# Altium schematic sheet Optical Compressor V2.SchDoc (part 2 of 2)
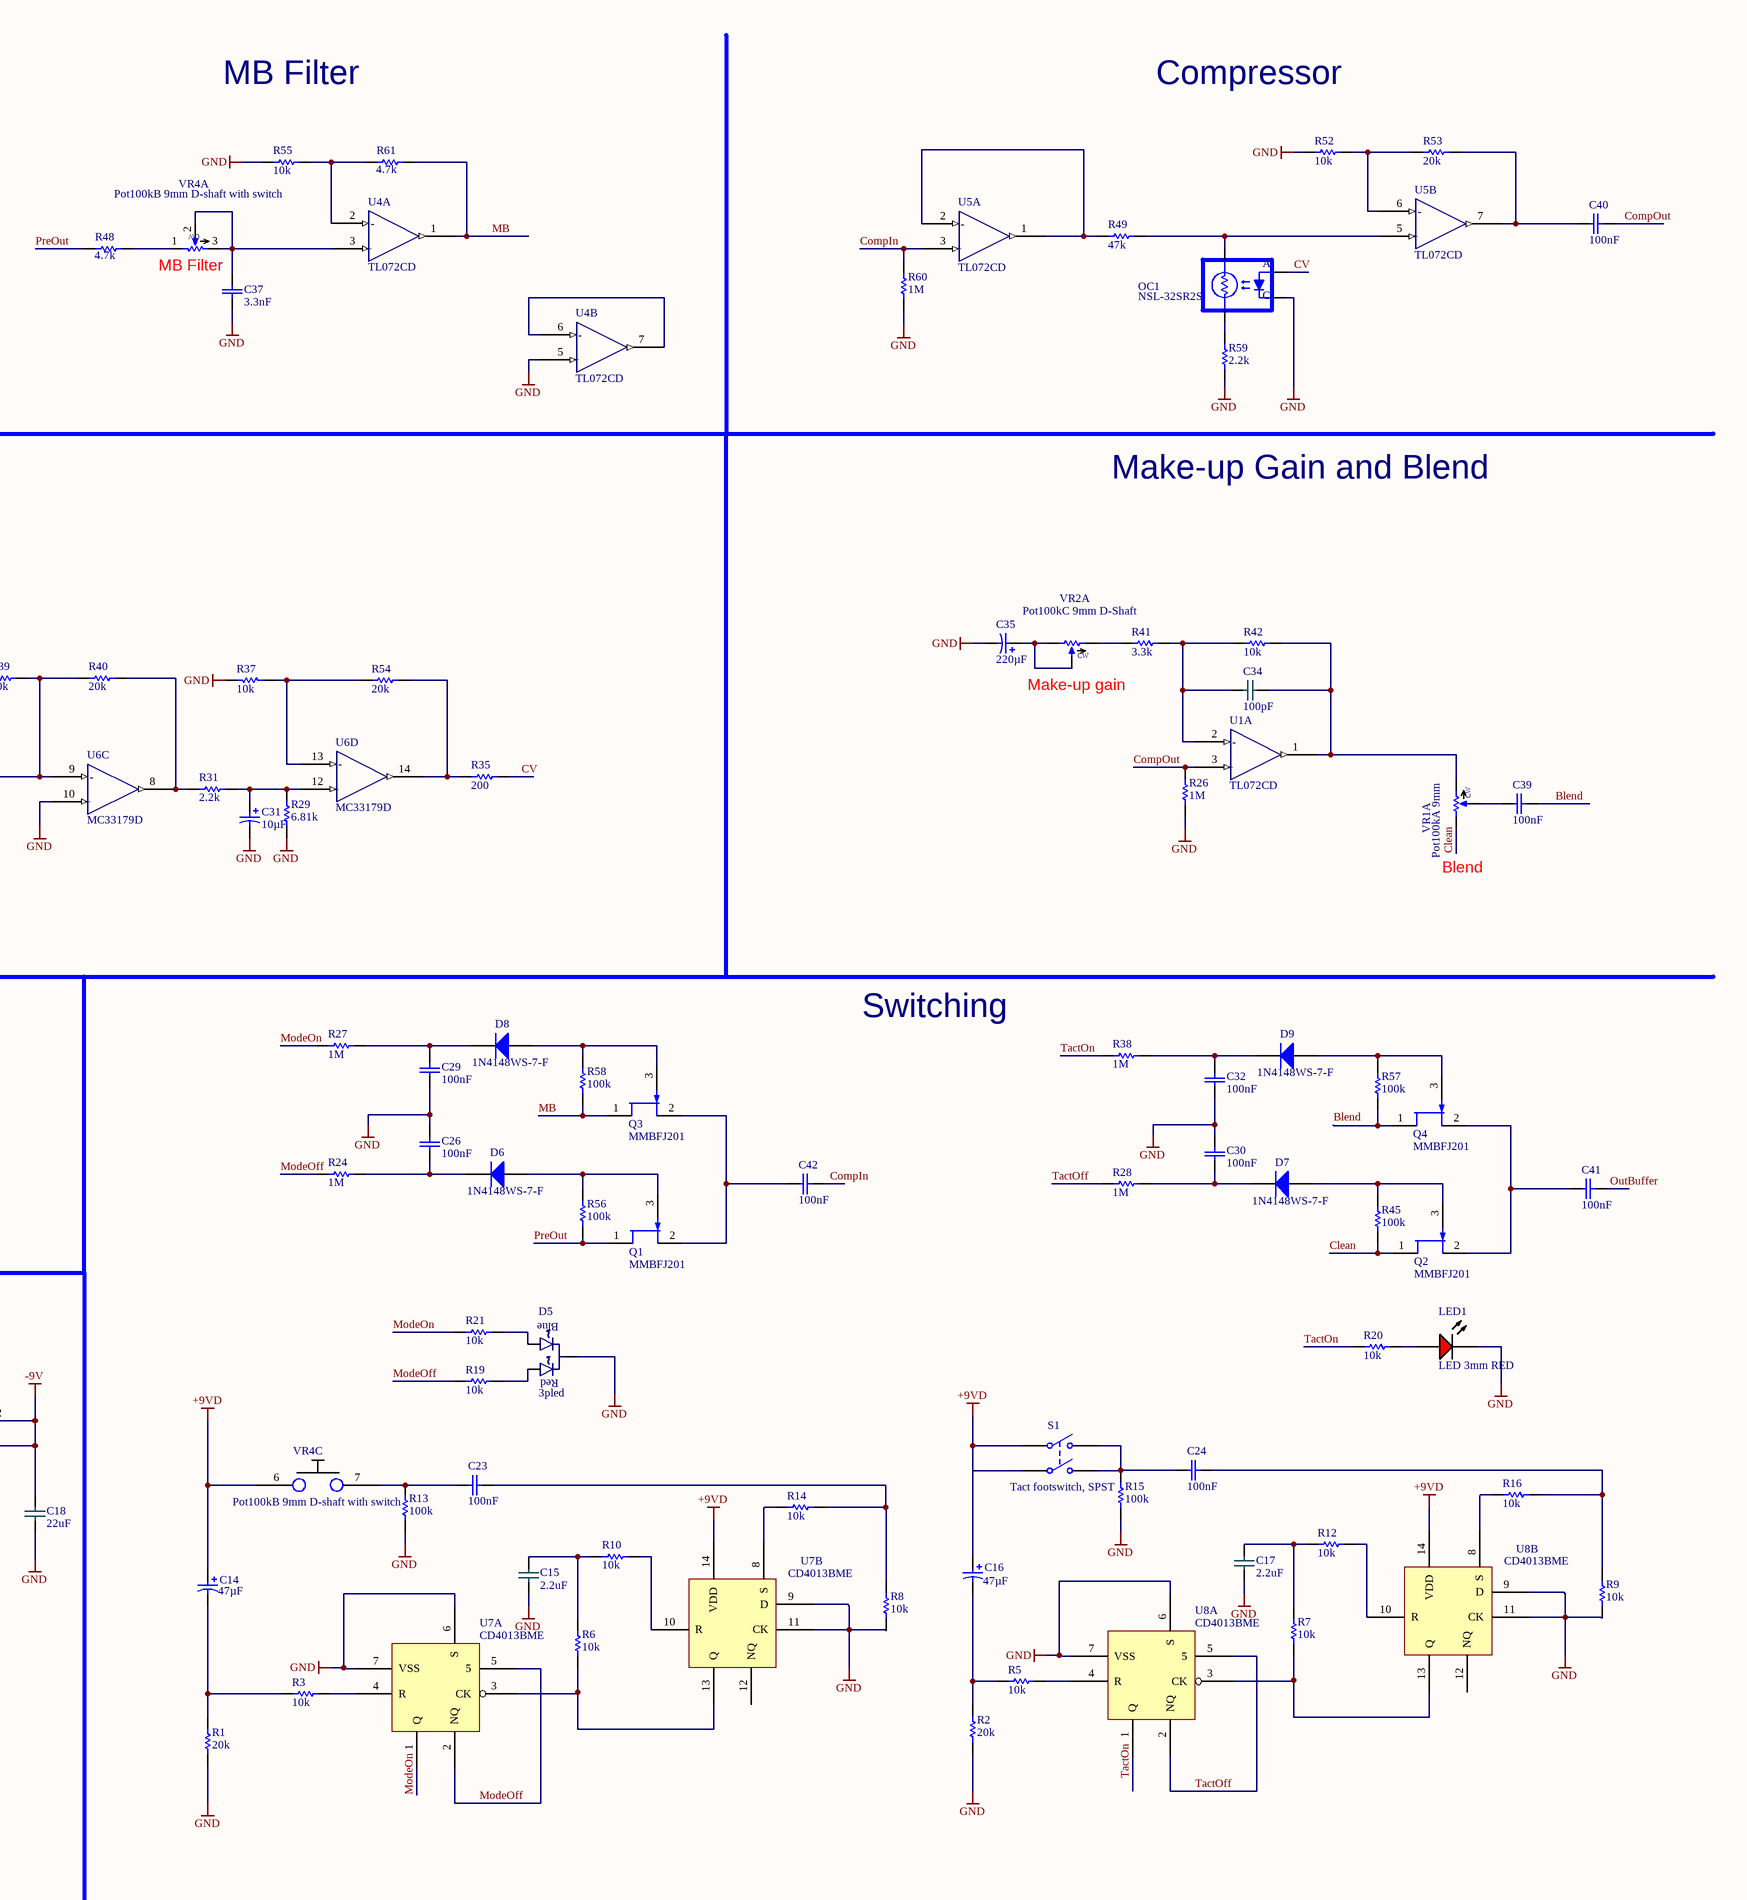
[diagram p2: Optical Compressor V2.SchDoc, right]

## Library data of the parts
C1 C19 C31 = CMP-00115-4: Cap Aluminum 10uF 35V ±20% (5x5.4mm) SMD 2000h 85°C; + Tolerance: 20%; Lifetime @ Max. Temp. (hours): 2000h; Maximum operating temperature: 85°C; Rated Voltage: 35V; - Tolerance: 20%
C2-C5 C7-C11 C13 C23 C24 C26 C27 C29 C30 C32 C38 = CMP-04109-3: Cap 100nF 0603 X7R 50V +-10%; Tolerance (+-): 10%; Dielectric: X7R; Height: 900µm; Maximum operating temperature: 125°C; Rated Voltage: 50V; Size (Imperial): 0603
C14 C16 = CMP-00096-4: Cap Aluminum 47uF 16V ±20% (6.3x5.4mm) SMD 2000h 85°C; Rated Voltage: 16V; + Tolerance: 20%; Lifetime @ Max. Temp. (hours): 2000h; Maximum operating temperature: 85°C; - Tolerance: 20%
C15 C17 = CMP-019-0081-11: 2.2uF, 25V, X5R, 20%; Dielectric Material: Ceramic; ComponentLink1Description: http://www.mouser.com/ds/2/427/vjw1bcbascomseries-223529.pdf?src-supplier=Mouser; ComponentLink6Description: https://datasheet.ciiva.com/14911/c-series-generalappl-b11-14911752.pdf?src-supplier=Digi-Key; ComponentLink1URL: http://www.mouser.com/ds/2/427/vjw1bcbascomseries-223529.pdf?src-supplier=Mouser; Width: 0.049inch; Dielectric: X5R; Termination: SMD/SMT; ComponentLink5URL: https://datasheet.ciiva.com/14911/c-series-generalappl-b11-14911751.pdf?src-supplier=Digi-Key; Source: main.SchLib; Number of Pins: 2; Voltage Rating: 25V; Composition: Ceramic; Package Quantity: 2000; Value: 2.2 uF; ComponentLink6URL: https://datasheet.ciiva.com/14911/c-series-generalappl-b11-14911752.pdf?src-supplier=Digi-Key; Packaging: Tape and Reel; ComponentLink2Description: http://www.vishay.com/docs/28548/vjw1bcbascomseries.pdf?src-supplier=Avnet; Tolerance: 20%; Voltage Rating (DC): 25V; Pricing 1: 1 = 0,27000, 10 = 0,11500, 50 = 0,11500, 100 = 0,07900, 1000 = 0,05900, 10000 = 0,04200 (USD); Weight: 0.000194oz; Case Code (Metric): 2012; ComponentLink4URL: https://datasheet.ciiva.com/14911/c-series-generalappl-b11-14911750.pdf?src-supplier=Digi-Key; Mount: Surface Mount; RoHS: Yes; Design Item ID: Cap 0805 2.2uF; Lead Free: Lead Free; Max Operating Temperature: 85°C; ComponentLink2URL: http://www.vishay.com/docs/28548/vjw1bcbascomseries.pdf?src-supplier=Avnet; Stock 1: 3928; Length: 2mm; ComponentLink4Description: https://datasheet.ciiva.com/14911/c-series-generalappl-b11-14911750.pdf?src-supplier=Digi-Key; Min Operating Temperature: -55°C; ComponentLink5Description: https://datasheet.ciiva.com/14911/c-series-generalappl-b11-14911751.pdf?src-supplier=Digi-Key; Case Code (Imperial): 0805; Case/Package: 0805; ComponentLink3URL: https://datasheet.ciiva.com/24219/c2012x5r1e225m125ac-265004-24219065.pdf?src-supplier=Mouser; ComponentLink3Description: https://datasheet.ciiva.com/24219/c2012x5r1e225m125ac-265004-24219065.pdf?src-supplier=Mouser; Thickness: 0.057inch; Height: 1.25mm; REACH SVHC: Unknown
C18 C21 = CMP-019-0032-4: 22uF, 16V, X5R, 20%; Dissipation Factor: 0.035%; Dielectric Material: Ceramic; Source: main.SchLib; PackageReference: C1206; Voltage Rating (DC): 16V; Tolerance: 20%; Depth: 1.25mm; LatestRevisionDate: 29-May-2009; Height: 0.85mm; Termination: SMD/SMT; Lead Free: Lead Free; Width: 0.049inch; Min Operating Temperature: -55°C; RoHS: Yes; Voltage Rating: 16V; PackageDescription: Chip Capacitor; Stock 1: 446787; Mount: Surface Mount; Case Code (Metric): 2012; Published: 8-Jun-2000; Design Item ID: Cap 0805 22uF; Dielectric: X5R; Capacitance: 22uF; Thickness: 0.039inch; Packaging: Tape and Reel; Case/Package: 0805; Weight: 0.000335oz; Max Operating Temperature: 85°C; REACH SVHC: No SVHC; Pricing 1: 1 = 0,49000, 10 = 0,34000, 50 = 0,34000, 100 = 0,22400, 1000 = 0,14100, 10000 = 0,11200 (USD); Voltage: 16V; Publisher: Altium Limited; Length: 2mm; Case Code (Imperial): 0805; Package Quantity: 3000; LatestRevisionNote: IPC-7351 Footprint Added.
C20 C35 = CMP-00098-4: Cap Aluminum 220uF 16V ±20% (6.3x7.7mm) SMD 2000h 85°C; Lifetime @ Max. Temp. (hours): 2000h; Rated Voltage: 16V; Maximum operating temperature: 85°C; - Tolerance: 20%; + Tolerance: 20%
C22 = CMP-019-0066-14: 330pF,  5%,  50V,  C0G; Dielectric Material: Ceramic; Temperature Coefficient: 30ppm/°C; Dissipation Factor: 0.5%; Tolerance: 5%; REACH SVHC: No SVHC; RoHS: Yes; Contact Material: Tin; Height: 0.8mm; Package Quantity: 1; ComponentLink5URL: https://datasheet.ciiva.com/14597/70095383-14597551.pdf?src-supplier=Allied+Electronics; Width: 0.8mm; Lead Pitch: 0.7mm; ComponentLink2Description: https://datasheet.ciiva.com/14589/70095383-14589452.pdf?src-supplier=Allied+Electronics; Max Operating Temperature: 125°C; Radiation Hardening: No; Voltage Rating: 50V; Dielectric: C0G; ComponentLink4Description: https://datasheet.ciiva.com/7823/kem-c1003-c0g-smd-7823742.pdf?src-supplier=Element14; Case Code (Metric): 1608; ComponentLink2URL: https://datasheet.ciiva.com/14589/70095383-14589452.pdf?src-supplier=Allied+Electronics; Lead Free: Lead Free; Termination: SMD/SMT; Capacitance: 330pF; Stock 1: 158995; ComponentLink3Description: https://datasheet.ciiva.com/7823/kem-c1003-c0g-smd-7823741.pdf?src-supplier=Element14; Number of Pins: 2; Thickness: 0.034inch; Contact Plating: Tin,Matte; ComponentLink1Description: https://datasheet.ciiva.com/144/docfinderpartnumber-c0603c331j5gactu-144424.pdf?src-supplier=Digi-Key; ComponentLink5Description: https://datasheet.ciiva.com/14597/70095383-14597551.pdf?src-supplier=Allied+Electronics; Mount: Surface Mount,PCB; Packaging: Tape and Reel; ComponentLink4URL: https://datasheet.ciiva.com/7823/kem-c1003-c0g-smd-7823742.pdf?src-supplier=Element14; Pricing 1: 1=0,100000, 10=0,039000, 100=0,027000, 500=0,020000, 1000=0,016000, 4000=0,011000 (USD); Source: main.SchLib; ComponentLink3URL: https://datasheet.ciiva.com/7823/kem-c1003-c0g-smd-7823741.pdf?src-supplier=Element14; Design Item ID: Cap 0603 330pF; Depth: 0.8mm; Length: 1.6mm; Case Code (Imperial): 0603; Case/Package: 0603; Voltage: 50V; Min Operating Temperature: -55°C; Voltage Rating (DC): 50V; ComponentLink1URL: https://datasheet.ciiva.com/144/docfinderpartnumber-c0603c331j5gactu-144424.pdf?src-supplier=Digi-Key
C25 = CMP-04113-3: Cap 1µF 0805 X7R 50V +-10%; Tolerance (+-): 10%; Dielectric: X7R; Maximum operating temperature: 125°C; Height: 1.45mm; Size (Imperial): 0805; Rated Voltage: 50V
C28 C39-C42 = CMP-04102-2: Cap 100nF 1206 C0G 50V +-5%; Tolerance (+-): 5%; Dielectric: C0G; Height: 1.8mm; Size (Imperial): 1206; Rated Voltage: 50V; Maximum operating temperature: 125°C
C33 = CMP-04095-2: Cap 10nF 0603 C0G 50V +-5%; Tolerance (+-): 5%; Dielectric: C0G; Maximum operating temperature: 125°C; Height: 900µm; Size (Imperial): 0603; Rated Voltage: 50V
C34 = CMP-019-0054-13: 100pF, 50V, COG,  5%; Dielectric: C0G; Case/Package: 0603; Design Item ID: Cap 0603 100pF; Length: 0.063inch; Max Operating Temperature: 125°C; Min Operating Temperature: -55°C; Mount: Surface Mount; Packaging: Cut Tape; Pricing 1: 1 = 0,10000, 10 = 0,02400, 50 = 0,02400, 100 = 0,02200, 1000 = 0,01900, 10000 = 0,01100 (USD); RoHS: Yes; Source: main.SchLib; Stock 1: 12395; Tolerance: 5%; Value: 100pF; Voltage Rating (DC): 50V; Case Code (Imperial): 0603; Case Code (Metric): 1608; LatestRevisionDate: 29-May-2009; LatestRevisionNote: IPC-7351 Footprint Added.; PackageDescription: Chip Capacitor; PackageReference: C1206; Published: 8-Jun-2000; Publisher: Altium Limited; REACH SVHC: Unknown; Thickness: 0.034inch; Voltage Rating: 50V; Width: 0.031inch
C36 = CMP-04086-1: Cap 100pF 0603 C0G 50V +-5%; Tolerance (+-): 5%; Maximum operating temperature: 125°C; Rated Voltage: 50V; Dielectric: C0G; Height: 900µm; Size (Imperial): 0603
C37 = CMP-04092-2: Cap 3.3nF 0603 C0G 50V +-5%; Tolerance (+-): 5%; Maximum operating temperature: 125°C; Size (Imperial): 0603; Dielectric: C0G; Rated Voltage: 50V; Height: 900µm
D1 D3 = CMP-029-0015-3: 12V Zener; Manufacturer: Vishay Semiconductors; Impedance: 9R; Power Dissipation: 1W; Tolerance: 10%; Element Configuration: Single; Max Reverse Leakage Current: 5uA; ComponentLink3Description: http://www.vishay.com/docs/85782/sml4728.pdf?src-supplier=Avnet; Package Quantity: 7500; Source: main.SchLib; ComponentLink2Description: http://www.mouser.com/ds/2/427/sml4728-67952.pdf?src-supplier=Mouser; Manufacturer Part Number: SML4742-E3/5A; Mount: Surface Mount; RoHS: Yes; Max Power Dissipation: 1W; Number of Pins: 2; ComponentLink1URL: https://media.digikey.com/pdf/Data%20Sheets/Vishay%20Siliconix%20PDFs/SML4728-SML4764A.pdf?src-supplier=Digi-Key; Radiation Hardening: No; ComponentLink1Description: https://media.digikey.com/pdf/Data%20Sheets/Vishay%20Siliconix%20PDFs/SML4728-SML4764A.pdf?src-supplier=Digi-Key; Stock 1: 7485; ComponentLink2URL: http://www.mouser.com/ds/2/427/sml4728-67952.pdf?src-supplier=Mouser; Packaging: Tape and Reel; Voltage Tolerance: 10%; Min Operating Temperature: -65°C; Pricing 1: 1 = 0,50000, 10 = 0,42600, 25 = 0,39760, 100 = 0,31800, 250 = 0,29524, 500 = 0,24982, 1000 = 0,19305, 2500 = 0,17602 (USD); Case/Package: SMA; Design Item ID: SML4742-E3/5A; Zener Voltage: 12V; Mouser part: 78-SML4742-E3/5A; ComponentLink3URL: http://www.vishay.com/docs/85782/sml4728.pdf?src-supplier=Avnet; Max Operating Temperature: 150°C
D2 = CMP-055-0006-A.3: Rectifier Diode, Schottky, 1 Phase, 1 Element, 0.5A, 20V V(RRM), Silicon
D4 = CMP-029-0000-5: ON SEMICONDUCTOR - SS14 - DIODE, SCHOTTKY, 1A, 40V, DO-214AC-2; Manufacturer: ON Semiconductor / Fairchild; Forward Voltage: 500mV; Max Forward Surge Current (Ifsm): 40A; Polarity: Standard; Power Dissipation: 1.1W; Element Configuration: Single; Peak Reverse Current: 200uA; Number of Elements: 1; Average Rectified Current: 1A; ComponentLink2URL: https://datasheet.ciiva.com/8303/ss19-8303766.pdf?src-supplier=Avnet; Source: main.SchLib; Mount: Surface Mount; ComponentLink4URL: https://datasheet.ciiva.com/7965/1766303-7965241.pdf?src-supplier=Element14; Termination: SMD/SMT; Height: 2.2mm; Lead Free: Lead Free; Packaging: Tape and Reel; Max Reverse Voltage (DC): 40V; Voltage Rating (DC): 40V; REACH SVHC: No SVHC; ComponentLink7Description: https://datasheet.ciiva.com/910/ss12-910697.pdf?src-supplier=Digi-Key; Current: 1A; Number of Pins: 2; ComponentLink8Description: https://datasheet.ciiva.com/22651/1880990-22651980.pdf?src-supplier=Element14; Radiation Hardening: No; Case/Package: SMA; ComponentLink1URL: https://datasheet.ciiva.com/4713/ss14-197224-4713938.pdf?src-supplier=Mouser; Number of Terminals: 2; ComponentLink6Description: https://datasheet.ciiva.com/25951/ss19-25951496.pdf?src-supplier=Avnet+Europe; Manufacturer Part Number: SS14; ComponentLink1Description: https://datasheet.ciiva.com/4713/ss14-197224-4713938.pdf?src-supplier=Mouser; Forward Current: 1A; Max Repetitive Reverse Voltage (Vrrm): 40V; ComponentLink3URL: https://datasheet.ciiva.com/910/ss12-910695.pdf?src-supplier=Digi-Key; Max Operating Temperature: 125°C; Output Current: 1A; Peak Non-Repetitive Surge Current: 40A; Stock 1: 302709; ComponentLink6URL: https://datasheet.ciiva.com/25951/ss19-25951496.pdf?src-supplier=Avnet+Europe; ComponentLink2Description: https://datasheet.ciiva.com/8303/ss19-8303766.pdf?src-supplier=Avnet; Current Rating: 1A; ComponentLink3Description: https://datasheet.ciiva.com/910/ss12-910695.pdf?src-supplier=Digi-Key; Voltage: 40V; ComponentLink8URL: https://datasheet.ciiva.com/22651/1880990-22651980.pdf?src-supplier=Element14; Pricing 1: 1 = 0,42000, 10 = 0,29400, 50 = 0,29400, 100 = 0,13500, 1000 = 0,10400, 10000 = 0,08100 (USD); ComponentLink4Description: https://datasheet.ciiva.com/7965/1766303-7965241.pdf?src-supplier=Element14; Length: 4.75mm; ComponentLink7URL: https://datasheet.ciiva.com/910/ss12-910697.pdf?src-supplier=Digi-Key; Min Operating Temperature: -65°C; Max Power Dissipation: 1.1W; Design Item ID: SS14; ComponentLink5URL: https://datasheet.ciiva.com/910/ss12-910696.pdf?src-supplier=Digi-Key; Width: 2.95mm; RoHS: Yes; ComponentLink5Description: https://datasheet.ciiva.com/910/ss12-910696.pdf?src-supplier=Digi-Key; Weight: 0.003739oz; Package Quantity: 7500
D5 = CMP-029-0001-5: 3pin led red/blue; Manufacturer Part Number: OSRBMC3131A; Manufacturer: OptoSupply; Darkglass part: D00-0004; Supplied by Darkglass: YES; RoHS: No; Source: main.SchLib; Stock 1: 650; Pricing 1: 1=0,51300, 5=0,40600, 25=0,24500, 100=0,22500, 500=0,21300 (USD); Selective Soldering: YES; Design Item ID: 3pled
D6-D9 D11 D12 = CMP-029-0008-5: Fast Switching Diode, 75 V, 0.3 A, -65 to 150 degC, 2-Pin SOD323, RoHS, Tape and Reel; Manufacturer: Pericom; Forward Current: 300mA; Power Rating: 200mW; Current: 2A; Forward Voltage: 1.25V; Peak Reverse Current: 1uA; Voltage Rating (DC): 75V; Recovery Time: 4ns; Current Rating: 150mA; Element Configuration: Single; Capacitance: 2pF; Polarity: Standard; Available Preview Images: 2D; Pricing 1: 1 = 0.19000, 10 = 0.17100, 100 = 0.09320, 500 = 0.05736, 1000 = 0.03911 (USD); Width: 1.4mm; Design Item ID: 1N4148WS-7-F; ComponentLink8URL: https://datasheet.ciiva.com/911/ds30097-911742.pdf?src-supplier=Digi-Key; ComponentLink19Description: http://datasheet.octopart.com/1N4148WS-7-F-Diodes-Inc.-datasheet-14053694.pdf?src-supplier=IIIC; ComponentLink20Description: http://datasheet.octopart.com/1N4148WS-7-F-Multicomp-datasheet-21397732.pdf?src-supplier=Newark; PackageDescription: 2-Pin Small Outline Diode, Body 1.7 x 1.3 mm; Packaging: Tape and Reel; ComponentLink3URL: https://datasheet.ciiva.com/16199/ds30097-16199061.pdf?src-supplier=Future+Electronics; ComponentLink20URL: http://datasheet.octopart.com/1N4148WS-7-F-Multicomp-datasheet-21397732.pdf?src-supplier=Newark; ComponentLink16URL: http://datasheet.octopart.com/1N4148WS-7-F-Diodes-Inc.-datasheet-479.pdf?src-supplier=Mouser; ComponentLink1Description: Manufacturer URL; ComponentLink10URL: https://datasheet.ciiva.com/911/ds30097-911743.pdf?src-supplier=Digi-Key; Source: main.SchLib; ComponentLink6Description: https://datasheet.ciiva.com/8300/ds30097-8300396.pdf?src-supplier=Avnet; Lead Free: Lead Free; ComponentLink5URL: https://datasheet.ciiva.com/1179/ds30097-1179355.pdf?src-supplier=Element14; ComponentLink11Description: http://datasheet.octopart.com/1N4148WS-7-F-Diodes-Inc.-datasheet-11839050.pdf?src-supplier=Newark; ComponentLink4URL: https://datasheet.ciiva.com/16472/ds30097-16472599.pdf?src-supplier=Avnet+Asia; ComponentLink13URL: http://datasheet.octopart.com/1N4148WS-7-F-Diodes-Inc.-datasheet-10031541.pdf?src-supplier=Newark; ComponentLink2Description: Datasheet; ComponentLink4Description: https://datasheet.ciiva.com/16472/ds30097-16472599.pdf?src-supplier=Avnet+Asia; PackageReference: SOD323-2; ComponentLink3Description: https://datasheet.ciiva.com/16199/ds30097-16199061.pdf?src-supplier=Future+Electronics; Mount: Surface Mount; Manufacturer Part Number: 1N4148WS-7-F; ComponentLink12Description: http://datasheet.octopart.com/1N4148WS-7-F-Diodes-Inc.-datasheet-8329243.pdf?src-supplier=Newark; ComponentLink9Description: https://datasheet.ciiva.com/25946/ds30097-25946926.pdf?src-supplier=Avnet+Europe; ComponentLink8Description: https://datasheet.ciiva.com/911/ds30097-911742.pdf?src-supplier=Digi-Key; ComponentLink15Description: http://datasheet.octopart.com/1N4148WS-7-F-Diodes-Inc.-datasheet-62305040.pdf?src-supplier=Element14; Power Dissipation: 200mW; ComponentLink13Description: http://datasheet.octopart.com/1N4148WS-7-F-Diodes-Inc.-datasheet-10031541.pdf?src-supplier=Newark; REACH SVHC: No SVHC; ComponentLink21URL: http://datasheet.octopart.com/1N4148WS-7-F-Pericom-datasheet-62305040.pdf?src-supplier=Newark; ComponentLink12URL: http://datasheet.octopart.com/1N4148WS-7-F-Diodes-Inc.-datasheet-8329243.pdf?src-supplier=Newark; Radiation Hardening: No; ComponentLink18URL: http://datasheet.octopart.com/1N4148WS-7-F-Diodes-Inc.-datasheet-7284054.pdf?src-supplier=Jameco; Height: 1mm; Max Forward Surge Current (Ifsm): 2A; ComponentLink1URL: http://www.diodes.com/; ComponentLink6URL: https://datasheet.ciiva.com/8300/ds30097-8300396.pdf?src-supplier=Avnet; ComponentLink10Description: https://datasheet.ciiva.com/911/ds30097-911743.pdf?src-supplier=Digi-Key; ComponentLink7URL: https://datasheet.ciiva.com/911/ds30097-911741.pdf?src-supplier=Digi-Key; Length: 1.8mm; Stock 1: 107341; ComponentLink18Description: http://datasheet.octopart.com/1N4148WS-7-F-Diodes-Inc.-datasheet-7284054.pdf?src-supplier=Jameco; ComponentLink17Description: http://datasheet.octopart.com/1N4148WS-7-F-Diodes-Inc.-datasheet-139480.pdf?src-supplier=Digi-Key; Max Repetitive Reverse Voltage (Vrrm): 75V; Max Reverse Voltage (DC): 75V; ComponentLink5Description: https://datasheet.ciiva.com/1179/ds30097-1179355.pdf?src-supplier=Element14; Package Quantity: 3000; Contact Plating: Tin; ComponentLink14Description: http://datasheet.octopart.com/1N4148WS-7-F-Diodes-Inc.-datasheet-34441419.pdf?src-supplier=Allied+Electronics; ComponentLink11URL: http://datasheet.octopart.com/1N4148WS-7-F-Diodes-Inc.-datasheet-11839050.pdf?src-supplier=Newark; ComponentLink7Description: https://datasheet.ciiva.com/911/ds30097-911741.pdf?src-supplier=Digi-Key; Voltage: 75V; DatasheetVersion: Rev. 25-2, 03/2016; ComponentLink17URL: http://datasheet.octopart.com/1N4148WS-7-F-Diodes-Inc.-datasheet-139480.pdf?src-supplier=Digi-Key; ComponentLink16Description: http://datasheet.octopart.com/1N4148WS-7-F-Diodes-Inc.-datasheet-479.pdf?src-supplier=Mouser; ComponentLink19URL: http://datasheet.octopart.com/1N4148WS-7-F-Diodes-Inc.-datasheet-14053694.pdf?src-supplier=IIIC; Reverse Recovery Time: 4ns; Peak Non-Repetitive Surge Current: 2A; Number of Pins: 2; ComponentLink15URL: http://datasheet.octopart.com/1N4148WS-7-F-Diodes-Inc.-datasheet-62305040.pdf?src-supplier=Element14; Average Rectified Current: 150mA; Weight: 0.000173oz; Max Surge Current: 2A; Max Operating Temperature: 150°C; Min Operating Temperature: -65°C; Output Current: 150mA; ComponentLink21Description: http://datasheet.octopart.com/1N4148WS-7-F-Pericom-datasheet-62305040.pdf?src-supplier=Newark; ComponentLink2URL: http://www.diodes.com/datasheets/ds30097.pdf; ComponentLink9URL: https://datasheet.ciiva.com/25946/ds30097-25946926.pdf?src-supplier=Avnet+Europe; ComponentLink14URL: http://datasheet.octopart.com/1N4148WS-7-F-Diodes-Inc.-datasheet-34441419.pdf?src-supplier=Allied+Electronics
D13 = CMP-055-0001-A.2: Rectifier Diode, Schottky, 2 Element, 0.2A, 30V V(RRM), Silicon; Forward Voltage: 800mV; Element Configuration: Dual; Peak Reverse Current: 2uA; Average Rectified Current: 200mA; Recovery Time: 5ns; Max Forward Surge Current (Ifsm): 600mA; Power Dissipation: 200mW; Mount: Surface Mount; REACH SVHC: No SVHC; Max Reverse Voltage (DC): 30V; Height: 0.9mm; Forward Current: 200mA; Max Repetitive Reverse Voltage (Vrrm): 30V; Lead Free: Lead Free; Max Operating Temperature: 125°C; Max Reverse Leakage Current: 2uA; Min Operating Temperature: -65°C; Number of Pins: 3; Reverse Recovery Time: 5ns; Radiation Hardening: No; Length: 2.2mm; Weight: 0.03g; Case/Package: SOT-323; Width: 1.35mm; Peak Non-Repetitive Surge Current: 600mA; Package Quantity: 1; Max Surge Current: 600mA; Packaging: Tape and Reel; Contact Plating: Tin,Matte
J1 = CMP-034-0002-1: Low Voltage Power Supply Connector; Darkglass part: D00-0019; Selective Soldering: Yes; ComponentLink1Description: Manufacturer Link; Design Item ID: DC Jack TH; Source: main.SchLib; ComponentLink1URL: http://domino.kycon.com/internet/Products.html; Supplied by Darkglass: Yes
J2 J3 = CMP-028-0129-3: Darkglass part: D00-0011; Selective Soldering: Yes; Design Item ID: Neutrik TRS Jack with metal nut; Supplied by Darkglass: Yes; Source: main.SchLib
L1 L2 = CMP-027-0006-1: General Purpose Inductor, 10uH, 10%, 1 Element, Ferrite-Core, SMD, 1514; Shielding: Unshielded; Test Frequency: 100kHz; DC Resistance (DCR): 230mR; Case/Size Code: 1514; Inductor Application: POWER INDUCTOR; Number of Functions: 1; Package Height: 2.7mm; Package Length: 3.8mm; Package Width: 3.5mm; Rated Current-Max: 760mA; Shape/Size Description: RECTANGULAR PACKAGE; Min Operating Temperature: -40°C; Packaging: Tape and Reel; Max Operating Temperature: 100°C; Tolerance: 10%; Core Material: Ferrite; Construction: Unshielded; Inductance-Nom (L): 10uH; Inductor Type: GENERAL PURPOSE INDUCTOR; Number of Pins: 4; Package Style: SMTMeter; REACH SVHC: Yes; RoHS Compliant: Yes; Series: CR32; Surface Mount: Yes; Terminal Placement: Dual Ended; Termination: Wraparound
L3 = CMP-027-0002-5: Ferrite Beads Multi-Layer High Current 1KOhm 25% 100MHz 1.6A 0.12Ohm DCR; Manufacturer Part Number: BLM21SP102SN1D; Manufacturer: Murata; Pricing 1: 1=0,29000, 10=0,17400, 100=0,12300, 500=0,10600, 1000=0,09400, 4000=0,08000 (USD); Stock 1: 10289; RoHS: No; Source: jimi.SchLib; Design Item ID: Ferrite BLM21SP102SN1
L4 = CMP-00005-3: FERRITE BEAD, AUDIO, 500 OHM 0402 Low THD+N; Number of Lines: 1; DC Resistance (DCR): 1.65R; Max Current Rating: 270mA; Width: 0.02inch; Case/Package: 0402; Mount: Surface Mount; Case Code (Metric): 1005; Length: 0.039inch; Case Code (Imperial): 0402; Height: 0.022inch; Max Operating Temperature: 125°C; Packaging: Tape and Reel; Min Operating Temperature: -55°C
LED1 = CMP-036-0000-1: THT LED round mono-color waterclear, WL-TMRW , RED; Darkglass part: D00-0042; Manufacturer: Wuerth Elektronik; PartNumber: 151034rs03000; Supplied by Darkglass: YES; Available Preview Images: 2D; ComponentLink2Description: Datasheet; Fitted: Fitted; Selective Soldering: YES; Source: main.SchLib; Mouser part: 710-151034RS03000; PackageReference: Type 3mm; Darkglass: D00-0042; ComponentLink2URL: http://katalog.we-online.de/pbs/datasheet/7448042001.pdfhttp://katalog.we-online.de/pbs/datasheet/7448042001.pdfhttp://katalog.we-online.de/pbs/datasheet/7448042001.pdfhttp://katalog.we-online.de/pbs/datasheet/151033BS03000.pdf; Emitting color: RED; Design Item ID: LED 3mm RED; ComponentLink1Description: Manufacturer URL; ComponentLink1URL: http://www.we-online.com
OC1 = NSL-32SR2S: Optoisolator Photocell Optocoupler 1 Channel; MF: Advanced Photonix; Price: None; Value: *; Package: - Advanced Photonix; Availability: Unavailable; SnapEDA_Link: https://www.snapeda.com/parts/NSL-32SR2S/Advanced%20Photonix/view-part/2598365/?ref=snap; MP: NSL-32SR2S
Q1-Q4 = CMP-028-0021-7: JFET N-CH 40V 350MW SOT23; Manufacturer: ON Semiconductor / Fairchild; Continuous Drain Current (ID): 1mA; Current Rating: 50mA; Breakdown Voltage: -40V; Element Configuration: Single; Package Quantity: 1; Case/Package: SOT-23; ComponentLink8Description: https://datasheet.ciiva.com/4437/mmbfj201-196106-4437754.pdf?src-supplier=Mouser; Length: 2.92mm; ComponentLink7Description: https://datasheet.ciiva.com/8084/mmbfj201-8084198.pdf?src-supplier=Avnet; Height: 0.93mm; ComponentLink2Description: https://datasheet.ciiva.com/1188/j201-1188339.pdf?src-supplier=Element14; ComponentLink1Description: https://datasheet.ciiva.com/960/mmbfj201-960915.pdf?src-supplier=Digi-Key; Stock 1: 0; ComponentLink10Description: https://datasheet.ciiva.com/26026/mmbfj201-26026604.pdf?src-supplier=Avnet+Europe; ComponentLink11Description: https://datasheet.ciiva.com/16775/mmbfj201-16775887.pdf?src-supplier=Future+Electronics; ComponentLink9Description: https://datasheet.ciiva.com/15224/getdatasheetpartid-92710-15224267.pdf?src-supplier=Verical; Source: main.SchLib; ComponentLink3URL: https://datasheet.ciiva.com/960/mmbfj201-960916.pdf?src-supplier=Digi-Key; Radiation Hardening: No; ComponentLink10URL: https://datasheet.ciiva.com/26026/mmbfj201-26026604.pdf?src-supplier=Avnet+Europe; Manufacturer Part Number: MMBFJ201; Number of Pins: 3; Max Power Dissipation: 350mW; REACH SVHC: No SVHC; Design Item ID: MMBFJ201; ComponentLink4URL: https://datasheet.ciiva.com/1209/mmbfj201-1209636.pdf?src-supplier=Farnell; Mouser part: 512-MMBFJ201; Weight: 0.03g; ComponentLink2URL: https://datasheet.ciiva.com/1188/j201-1188339.pdf?src-supplier=Element14; ComponentLink8URL: https://datasheet.ciiva.com/4437/mmbfj201-196106-4437754.pdf?src-supplier=Mouser; ComponentLink1URL: https://datasheet.ciiva.com/960/mmbfj201-960915.pdf?src-supplier=Digi-Key; ComponentLink3Description: https://datasheet.ciiva.com/960/mmbfj201-960916.pdf?src-supplier=Digi-Key; ComponentLink5Description: https://datasheet.ciiva.com/960/mmbfj201-960917.pdf?src-supplier=Digi-Key; Power Dissipation: 350mW; Min Operating Temperature: -55°C; Pricing 1: 1 = 0,45000, 10 = 0,35500, 100 = 0,24350, 500 = 0,16696, 1000 = 0,12522 (USD); Mount: Surface Mount; ComponentLink11URL: https://datasheet.ciiva.com/16775/mmbfj201-16775887.pdf?src-supplier=Future+Electronics; ComponentLink5URL: https://datasheet.ciiva.com/960/mmbfj201-960917.pdf?src-supplier=Digi-Key; Lead Free: Lead Free; Width: 1.3mm; ComponentLink4Description: https://datasheet.ciiva.com/1209/mmbfj201-1209636.pdf?src-supplier=Farnell; Voltage Rating (DC): 40V; RoHS: Yes; Max Operating Temperature: 150°C; Packaging: Tape and Reel; ComponentLink6Description: https://datasheet.ciiva.com/8084/mmbfj201-8084197.pdf?src-supplier=Avnet; Gate to Source Voltage (Vgs): -40V; ComponentLink6URL: https://datasheet.ciiva.com/8084/mmbfj201-8084197.pdf?src-supplier=Avnet; Drain to Source Voltage (Vdss): 40V; ComponentLink7URL: https://datasheet.ciiva.com/8084/mmbfj201-8084198.pdf?src-supplier=Avnet; ComponentLink9URL: https://datasheet.ciiva.com/15224/getdatasheetpartid-92710-15224267.pdf?src-supplier=Verical
R1 R2 R34 R40 R53 R54 = CMP-03341-2: Resistor 20k +-1% 0603 Thin film 0.1W +-50ppm/°C; Power: 100mW; Temperature Coefficient (ppm/°C): 50; Maximum working voltage: 75V; Tolerance (+-): 1%; Composition: Thin film; Size (Imperial): 0603
R3 R5-R10 R12 R14 R16 R19-R21 R32 R33 R37 R39 R42-R44 R50 R52 R55 = CMP-06207-1: Resistor 10k +-1% 0603 Thick film 0.1W +- 100ppm/°C; Maximum working voltage: 75V; Power: 100mW; Temperature Coefficient (ppm/°C): 100; Composition: Thick film; Size (Imperial): 0603; Tolerance (+-): 1%
R4 R18 = CMP-04716-2: Resistor 10R +-5% 0805 Thick film 0.125W +-200ppm/°C; Temperature Coefficient (ppm/°C): 200; Power: 125mW; Maximum working voltage: 150V; Tolerance (+-): 5%; Size (Imperial): 0805; Composition: Thick film
R11 = CMP-03268-2: Resistor 4.7k +-1% 0603 Thin film 0.1W +-50ppm/°C; Temperature Coefficient (ppm/°C): 50; Maximum working voltage: 75V; Power: 100mW; Composition: Thin film; Tolerance (+-): 1%; Size (Imperial): 0603
R13 R15 R22 R25 R45 R56-R58 = CMP-03428-2: Resistor 100k +-1% 0603 Thin film 0.1W +-50ppm/°C; Power: 100mW; Maximum working voltage: 75V; Temperature Coefficient (ppm/°C): 50; Composition: Thin film; Size (Imperial): 0603; Tolerance (+-): 1%
R17 = CMP-07060-1: Resistor 29.4k +-1% 0805 Thick film 0.125W +- 100ppm/°C; Maximum working voltage: 150V; Power: 125mW; Temperature Coefficient (ppm/°C): 100; Size (Imperial): 0805; Composition: Thick film; Tolerance (+-): 1%
R23 R47 = CMP-02362-2: Resistor 100R +-1% 0805 Thin film 0.125W +-50ppm/°C; Temperature Coefficient (ppm/°C): 50; Power: 125mW; Maximum working voltage: 150V; Composition: Thin film; Size (Imperial): 0805; Tolerance (+-): 1%
R24 R26-R28 R30 R38 R46 R60 = CMP-03540-2: Resistor 1M +-1% 0603 Thin film 0.1W +-50ppm/°C; Maximum working voltage: 75V; Power: 100mW; Temperature Coefficient (ppm/°C): 50; Composition: Thin film; Tolerance (+-): 1%; Size (Imperial): 0603
R29 R36 R51 = CMP-03288-2: Resistor 6.81k +-1% 0603 Thin film 0.1W +-50ppm/°C; Power: 100mW; Maximum working voltage: 75V; Temperature Coefficient (ppm/°C): 50; Tolerance (+-): 1%; Size (Imperial): 0603; Composition: Thin film
R31 R59 = CMP-03227-2: Resistor 2.2k +-1% 0603 Thin film 0.1W +-50ppm/°C; Power: 100mW; Temperature Coefficient (ppm/°C): 50; Maximum working voltage: 75V; Size (Imperial): 0603; Tolerance (+-): 1%; Composition: Thin film
R35 = CMP-02391-1: Resistor 200R +-1% 0805 Thin film 0.125W +-50ppm/°C; Maximum working voltage: 150V; Temperature Coefficient (ppm/°C): 50; Power: 125mW; Size (Imperial): 0805; Composition: Thin film; Tolerance (+-): 1%
R41 = CMP-03249-2: Resistor 3.3k +-1% 0603 Thin film 0.1W +-50ppm/°C; Maximum working voltage: 75V; Temperature Coefficient (ppm/°C): 50; Power: 100mW; Size (Imperial): 0603; Composition: Thin film; Tolerance (+-): 1%
R48 R61 = CMP-03268-2: Resistor 4.7k +-1% 0603 Thin film 0.1W +-50ppm/°C; Maximum working voltage: 75V; Temperature Coefficient (ppm/°C): 50; Power: 100mW; Size (Imperial): 0603; Tolerance (+-): 1%; Composition: Thin film
R49 = CMP-03387-2: Resistor 47k +-1% 0603 Thin film 0.1W +-50ppm/°C; Power: 100mW; Maximum working voltage: 75V; Temperature Coefficient (ppm/°C): 50; Tolerance (+-): 1%; Composition: Thin film; Size (Imperial): 0603
S1 = CMP-028-0082-7: Tactile Switches 12x12x4.3mm 130gf; Manufacturer Part Number: SKHCBFA010; Darkglass part: D00-0022; Manufacturer: ALPS; Electrical Life: 1000000Cycles; Max Current Rating: 50mA; Supplied by Darkglass: Yes; Voltage Rating (DC): 12V; Contact Current Rating: 5mA; Contact Resistance: 100mR; Actuator Length: 0.8mm; Operating Force: 1.27N; Contact Plating: Silver; Throw Configuration: SPST; Design Item ID: Tact footswitch; Depth: 12.5mm; Orientation: Straight; ComponentLink4Description: http://datasheet.octopart.com/SKHCBFA010-ALPS-datasheet-37145171.pdf?src-supplier=Master+Electronics; Termination: PC Pins; ComponentLink3URL: https://datasheet.ciiva.com/16156/skhc-16156011.pdf?src-supplier=Onlinecomponents.com; Length: 12mm; Lead Free: Lead Free; ComponentLink4URL: http://datasheet.octopart.com/SKHCBFA010-ALPS-datasheet-37145171.pdf?src-supplier=Master+Electronics; Selective Soldering: Yes; Color: Black; Current Rating: 50mA; Pricing 1: 1 = 0,83000, 10 = 0,83000, 50 = 0,69900, 100 = 0,62000, 1000 = 0,45500, 10000 = 0,42900 (USD); ComponentLink2URL: https://datasheet.ciiva.com/14142/skhc-eng-datasheet-14142492.pdf?src-supplier=Distrelec; Stock 1: 14972; Min Operating Temperature: -30°C; ComponentLink3Description: https://datasheet.ciiva.com/16156/skhc-16156011.pdf?src-supplier=Onlinecomponents.com; Packaging: Bulk; ComponentLink1Description: https://datasheet.ciiva.com/26906/getdatasheetpartid-652335-26906164.pdf?src-supplier=Verical; Max Operating Temperature: 85°C; Package Quantity: 3000; ComponentLink1URL: https://datasheet.ciiva.com/26906/getdatasheetpartid-652335-26906164.pdf?src-supplier=Verical; Mount: Through Hole; Max Voltage Rating (DC): 12V; Radiation Hardening: No; Source: main.SchLib; ComponentLink2Description: https://datasheet.ciiva.com/14142/skhc-eng-datasheet-14142492.pdf?src-supplier=Distrelec
U1 U2 U4 U5 = CMP-028-0012-7: Operational Amplifiers - Op Amps Dual Low Noise JFET SOIC8; Manufacturer 1: Texas Instruments; Operating Supply Voltage: 18V; Number of Elements: 2; Bandwidth: 3MHz; Dual Supply Voltage: 9V; Input Bias Current: 200pA; Min Dual Supply Voltage: 3.5V; Voltage Gain: 106.02dB; Max I/O Voltage: 10mV; Common Mode Rejection Ratio: 70dB; Input Offset Voltage (Vos): 3mV; Slew Rate: 13V/µs; Operating Supply Current: 1.4mA; Nominal Supply Current: 5mA; ComponentLink4URL: http://www.farnell.com/datasheets/1862384.pdf?src-supplier=Element14; ComponentLink4Description: http://www.farnell.com/datasheets/1862384.pdf?src-supplier=Element14; Manufacturer Part Number 1: TL072CD; REACH SVHC: No SVHC; Pricing 1: 1 = 0.71000, 10 = 0.59500, 50 = 0.59500, 100 = 0.38400, 1000 = 0.30700, 10000 = 0.25000 (USD); RoHS: Yes; Source: main.SchLib; ComponentLink1URL: http://www.ti.com/general/docs/lit/getliterature.tsp?genericPartNumber=TL072&&fileType=pdf&src-supplier=Avnet; Height: 1.58mm; Gain Bandwidth Product: 3MHz; ComponentLink5URL: http://focus.ti.com/lit/ds/symlink/tl074.pdf?src-supplier=Avnet+Asia; Number of Amplifiers: 2; ComponentLink2Description: https://www.distrelec.biz/Web/Downloads/_t/ds/tl07x-series_eng_tds.pdf?mime=application%2Fpdf&src-supplier=Distrelec; Radiation Hardening: No; ComponentLink3URL: http://www.ti.com/lit/ds/symlink/tl071a.pdf?src-supplier=Digi-Key; Unity Gain Bandwidth Product: 3MHz; Case/Package: D; Max Operating Temperature: 85°C; Packaging: Rail/Tube; Number of Circuits: 2; Number of Pins: 8; Length: 4.9mm; Number of Channels: 2; Package Quantity: 75; Min Operating Temperature: -40°C; Width: 3.91mm; Lead Free: Lead Free; Stock 1: 14514; ComponentLink3Description: http://www.ti.com/lit/ds/symlink/tl071a.pdf?src-supplier=Digi-Key; Nominal Gain Bandwidth Product: 3MHz; ComponentLink5Description: http://focus.ti.com/lit/ds/symlink/tl074.pdf?src-supplier=Avnet+Asia; Max Dual Supply Voltage: 18V; ComponentLink1Description: http://www.ti.com/general/docs/lit/getliterature.tsp?genericPartNumber=TL072&&fileType=pdf&src-supplier=Avnet; ComponentLink2URL: https://www.distrelec.biz/Web/Downloads/_t/ds/tl07x-series_eng_tds.pdf?mime=application%2Fpdf&src-supplier=Distrelec; Design Item ID: TL072CD; PartId: 1
U6 = CMP-028-0019-6: Operational Amplifiers - Op Amps 2-18V Quad Low Power Industrial Temp SOIC14; Manufacturer Part Number: MC33179DR2G; Manufacturer: ON Semiconductor; Max Dual Supply Voltage: 18V; Bandwidth: 5MHz; Common Mode Rejection Ratio: 80dB; Min Dual Supply Voltage: 2V; Number of Amplifiers: 4; Slew Rate: 2V/µs; Input Bias Current: 500nA; Voltage Gain: 106.02dB; Operating Supply Current: 1.7mA; Output Current: 80mA; Input Offset Voltage (Vos): 3mV; Output Current per Channel: 100mA; ComponentLink2Description: https://datasheet.ciiva.com/5787/89824-5787686.pdf?src-supplier=Farnell; ComponentLink12URL: http://datasheet.octopart.com/MC33179DR2G-ON-Semiconductor-datasheet-82522822.pdf?src-supplier=Newark; Min Operating Temperature: -40°C; Pricing 1: 1 = 0.97000, 10 = 0.86300, 100 = 0.67300, 500 = 0.55598, 1000 = 0.43893 (USD); Case/Package: SOIC; Stock 1: 2859; Width: 4mm; Lead Free: Lead Free; ComponentLink11URL: http://datasheet.octopart.com/MC33179DR2G-ON-Semiconductor-datasheet-14137761.pdf?src-supplier=IIIC; ComponentLink3Description: https://datasheet.ciiva.com/26056/mc33178-d-26056822.pdf?src-supplier=Avnet+Europe; ComponentLink4URL: https://datasheet.ciiva.com/1796/mc33178-d-1796957.pdf?src-supplier=Digi-Key; Length: 8.75mm; Mouser part: 863-MC33179DR2G; REACH SVHC: No SVHC; ComponentLink11Description: http://datasheet.octopart.com/MC33179DR2G-ON-Semiconductor-datasheet-14137761.pdf?src-supplier=IIIC; Max Operating Temperature: 85°C; ComponentLink8URL: https://datasheet.ciiva.com/8078/89824-8078570.pdf?src-supplier=Element14; ComponentLink6URL: https://datasheet.ciiva.com/2973/mc33178-d-2973668.pdf?src-supplier=Avnet; ComponentLink3URL: https://datasheet.ciiva.com/26056/mc33178-d-26056822.pdf?src-supplier=Avnet+Europe; Gain Bandwidth Product: 5MHz; Nominal Gain Bandwidth Product: 5MHz; ComponentLink1Description: https://datasheet.ciiva.com/30481/0900766b81276f1b-30481445.pdf?src-supplier=RSComponents; Number of Channels: 4; ComponentLink8Description: https://datasheet.ciiva.com/8078/89824-8078570.pdf?src-supplier=Element14; ComponentLink7Description: https://datasheet.ciiva.com/16212/mc33178-d-16212327.pdf?src-supplier=Future+Electronics; ComponentLink12Description: http://datasheet.octopart.com/MC33179DR2G-ON-Semiconductor-datasheet-82522822.pdf?src-supplier=Newark; ComponentLink7URL: https://datasheet.ciiva.com/16212/mc33178-d-16212327.pdf?src-supplier=Future+Electronics; ComponentLink5URL: https://datasheet.ciiva.com/1796/mc33178-d-1796959.pdf?src-supplier=Digi-Key; ComponentLink1URL: https://datasheet.ciiva.com/30481/0900766b81276f1b-30481445.pdf?src-supplier=RSComponents; ComponentLink5Description: https://datasheet.ciiva.com/1796/mc33178-d-1796959.pdf?src-supplier=Digi-Key; Power Supply Rejection Ratio (PSRR): 80dB; Number of Pins: 14; Unity Gain Bandwidth Product: 5MHz; ComponentLink6Description: https://datasheet.ciiva.com/2973/mc33178-d-2973668.pdf?src-supplier=Avnet; Radiation Hardening: No; Contact Plating: Tin; Package Quantity: 2500; Number of Elements: 4; Nominal Supply Current: 1.7mA; Source: main.SchLib; Packaging: Tape and Reel; Design Item ID: MC33179D; Number of Circuits: 4; ComponentLink4Description: https://datasheet.ciiva.com/1796/mc33178-d-1796957.pdf?src-supplier=Digi-Key; Max Supply Voltage: 18V; ComponentLink9URL: https://datasheet.ciiva.com/1796/mc33178-d-1796958.pdf?src-supplier=Digi-Key; ComponentLink10Description: http://datasheet.octopart.com/MC33179DR2G-ON-Semiconductor-datasheet-164248.pdf?src-supplier=Newark; Height: 1.5mm; Halogen Free: Halogen Free; ComponentLink2URL: https://datasheet.ciiva.com/5787/89824-5787686.pdf?src-supplier=Farnell; ComponentLink10URL: http://datasheet.octopart.com/MC33179DR2G-ON-Semiconductor-datasheet-164248.pdf?src-supplier=Newark; ComponentLink9Description: https://datasheet.ciiva.com/1796/mc33178-d-1796958.pdf?src-supplier=Digi-Key; PartId: 1
U7 U8 = CMP-032-0004-3: IC D-TYPE POS TRG DUAL 14SOIC; Manufacturer Part Number: CD4013BME4; Manufacturer: Texas Instruments; Number of Bits: 2; Min Supply Voltage: 3V; Number of Outputs: 4; Low Level Output Current: 6.8mA; Propagation Delay: 300ns; Polarity: Non-Inverting; Number of Bits per Element: 1; Max Supply Voltage: 18V; Frequency: 24MHz; High Level Output Current: -4.2mA; Logic Function: AND; Turn-On Delay Time: 45ns; Clock Edge Trigger Type: Positive Edge; Quiescent Current: 20uA; Packaging: Rail/Tube; Lead Free: Lead Free; Package Quantity: 50; Number of Elements: 2; ComponentLink2URL: https://datasheet.ciiva.com/1857/cd4013b-1857723.pdf?src-supplier=Digi-Key; Contact Plating: Gold; Number of Circuits: 2; Number of Pins: 14; Weight: 0.004564oz; Number of Input Lines: 1; Pricing 1: 1 = 0,48000, 10 = 0,39400, 50 = 0,39400, 100 = 0,24000, 1000 = 0,18600, 10000 = 0,14800 (USD); Design Item ID: CD4013BME; RoHS: Yes; ComponentLink1URL: https://datasheet.ciiva.com/14292/cd4013b-mil-14292615.pdf?src-supplier=Avnet; Case/Package: SOIC; ComponentLink2Description: https://datasheet.ciiva.com/1857/cd4013b-1857723.pdf?src-supplier=Digi-Key; Stock 1: 2814; Number of Output Lines: 1; Min Operating Temperature: -55°C; Max Operating Temperature: 125°C; Mount: Surface Mount; Source: main.SchLib; ComponentLink1Description: https://datasheet.ciiva.com/14292/cd4013b-mil-14292615.pdf?src-supplier=Avnet; PartId: 1
U9 = CMP-0069-01166-3: 1.4MHz Cuk Converter, 5-pin SOT-23, Pb-Free; Manufacturer: Texas Instruments; PackageTopMarking: S40B*XTT; PowerWise: N; CompType: Switcher; ComponentLink1URL: http://www.ti.com/general/docs/lit/getliterature.tsp?genericPartNumber=LM2611&fileType=pdf; RoHS: Y; PinCount: 5; PackageReference: DBV0005A; PackageDescription: Molded SOT-23, .115 x .063 x .040 in Body, 5 Lead, .0375 in Pitch; ComponentLink1Description: Datasheet URL
V1 V2 = CMP-021-0016-3: Varistor 0402 28VDC 6.8pF 10% Audio Line; Manufacturer: TDK; RoHS: No; Stock 1: 19800; Source: jimi.SchLib; Pricing 1: 1=0,37000, 10=0,34800, 100=0,12200, 500=0,10400, 1000=0,07100, 2500=0,05900 (USD); Design Item ID: Var AVRF101U6R8KT242; Manufacturer Part Number: AVRF101U6R8KT242
VR1 = CMP-028-0051-1: LJV 9mm pot; Darkglass part: D00-0000; Manufacturer Part Number: RP09110NOBA-H02-1484 (A104,KA15A6.5); SET POSITION: 1; Selective Soldering: YES; Value: 100kA; Design Item ID: Pot100kA 9mm; Source: main.SchLib; Supplied by Darkglass: YES; PartId: 1
VR2 = CMP-04321-1: LJV 9mm pot; Manufacturer Part Number 1: RP09110NOBA-H02-2253; Darkglass part: D00-0002; Supplied by Darkglass: YES; SET POSITION: 1; Value: 100kC; Design Item ID: Pot100kC 9mm; Source: main.SchLib; Selective Soldering: YES; PartId: 1
VR3 = CMP-028-0051-2: LJV 9mm pot; Manufacturer Part Number: RP09110NOBA-H02-1484 (A104,KA15A6.5); Darkglass part: D00-0000; Supplied by Darkglass: YES; SET POSITION: 1; Value: 100kA; Source: main.SchLib; Design Item ID: Pot100kA 9mm; Selective Soldering: YES; PartId: 1
VR4 = CMP-04127-2: LJV 9mm pot D-shaft with switch; Value: 100kC; Selective Soldering: YES; SET POSITION: 1; Darkglass part: N/A; Supplied by Darkglass: YES; Design Item ID: Pot100kB 9mm D-shaft; Manufacturer: LJV; PartId: 1